# Altium schematic sheet 19 PF0100 PMIC.SchDoc
size 513 x 386 mm
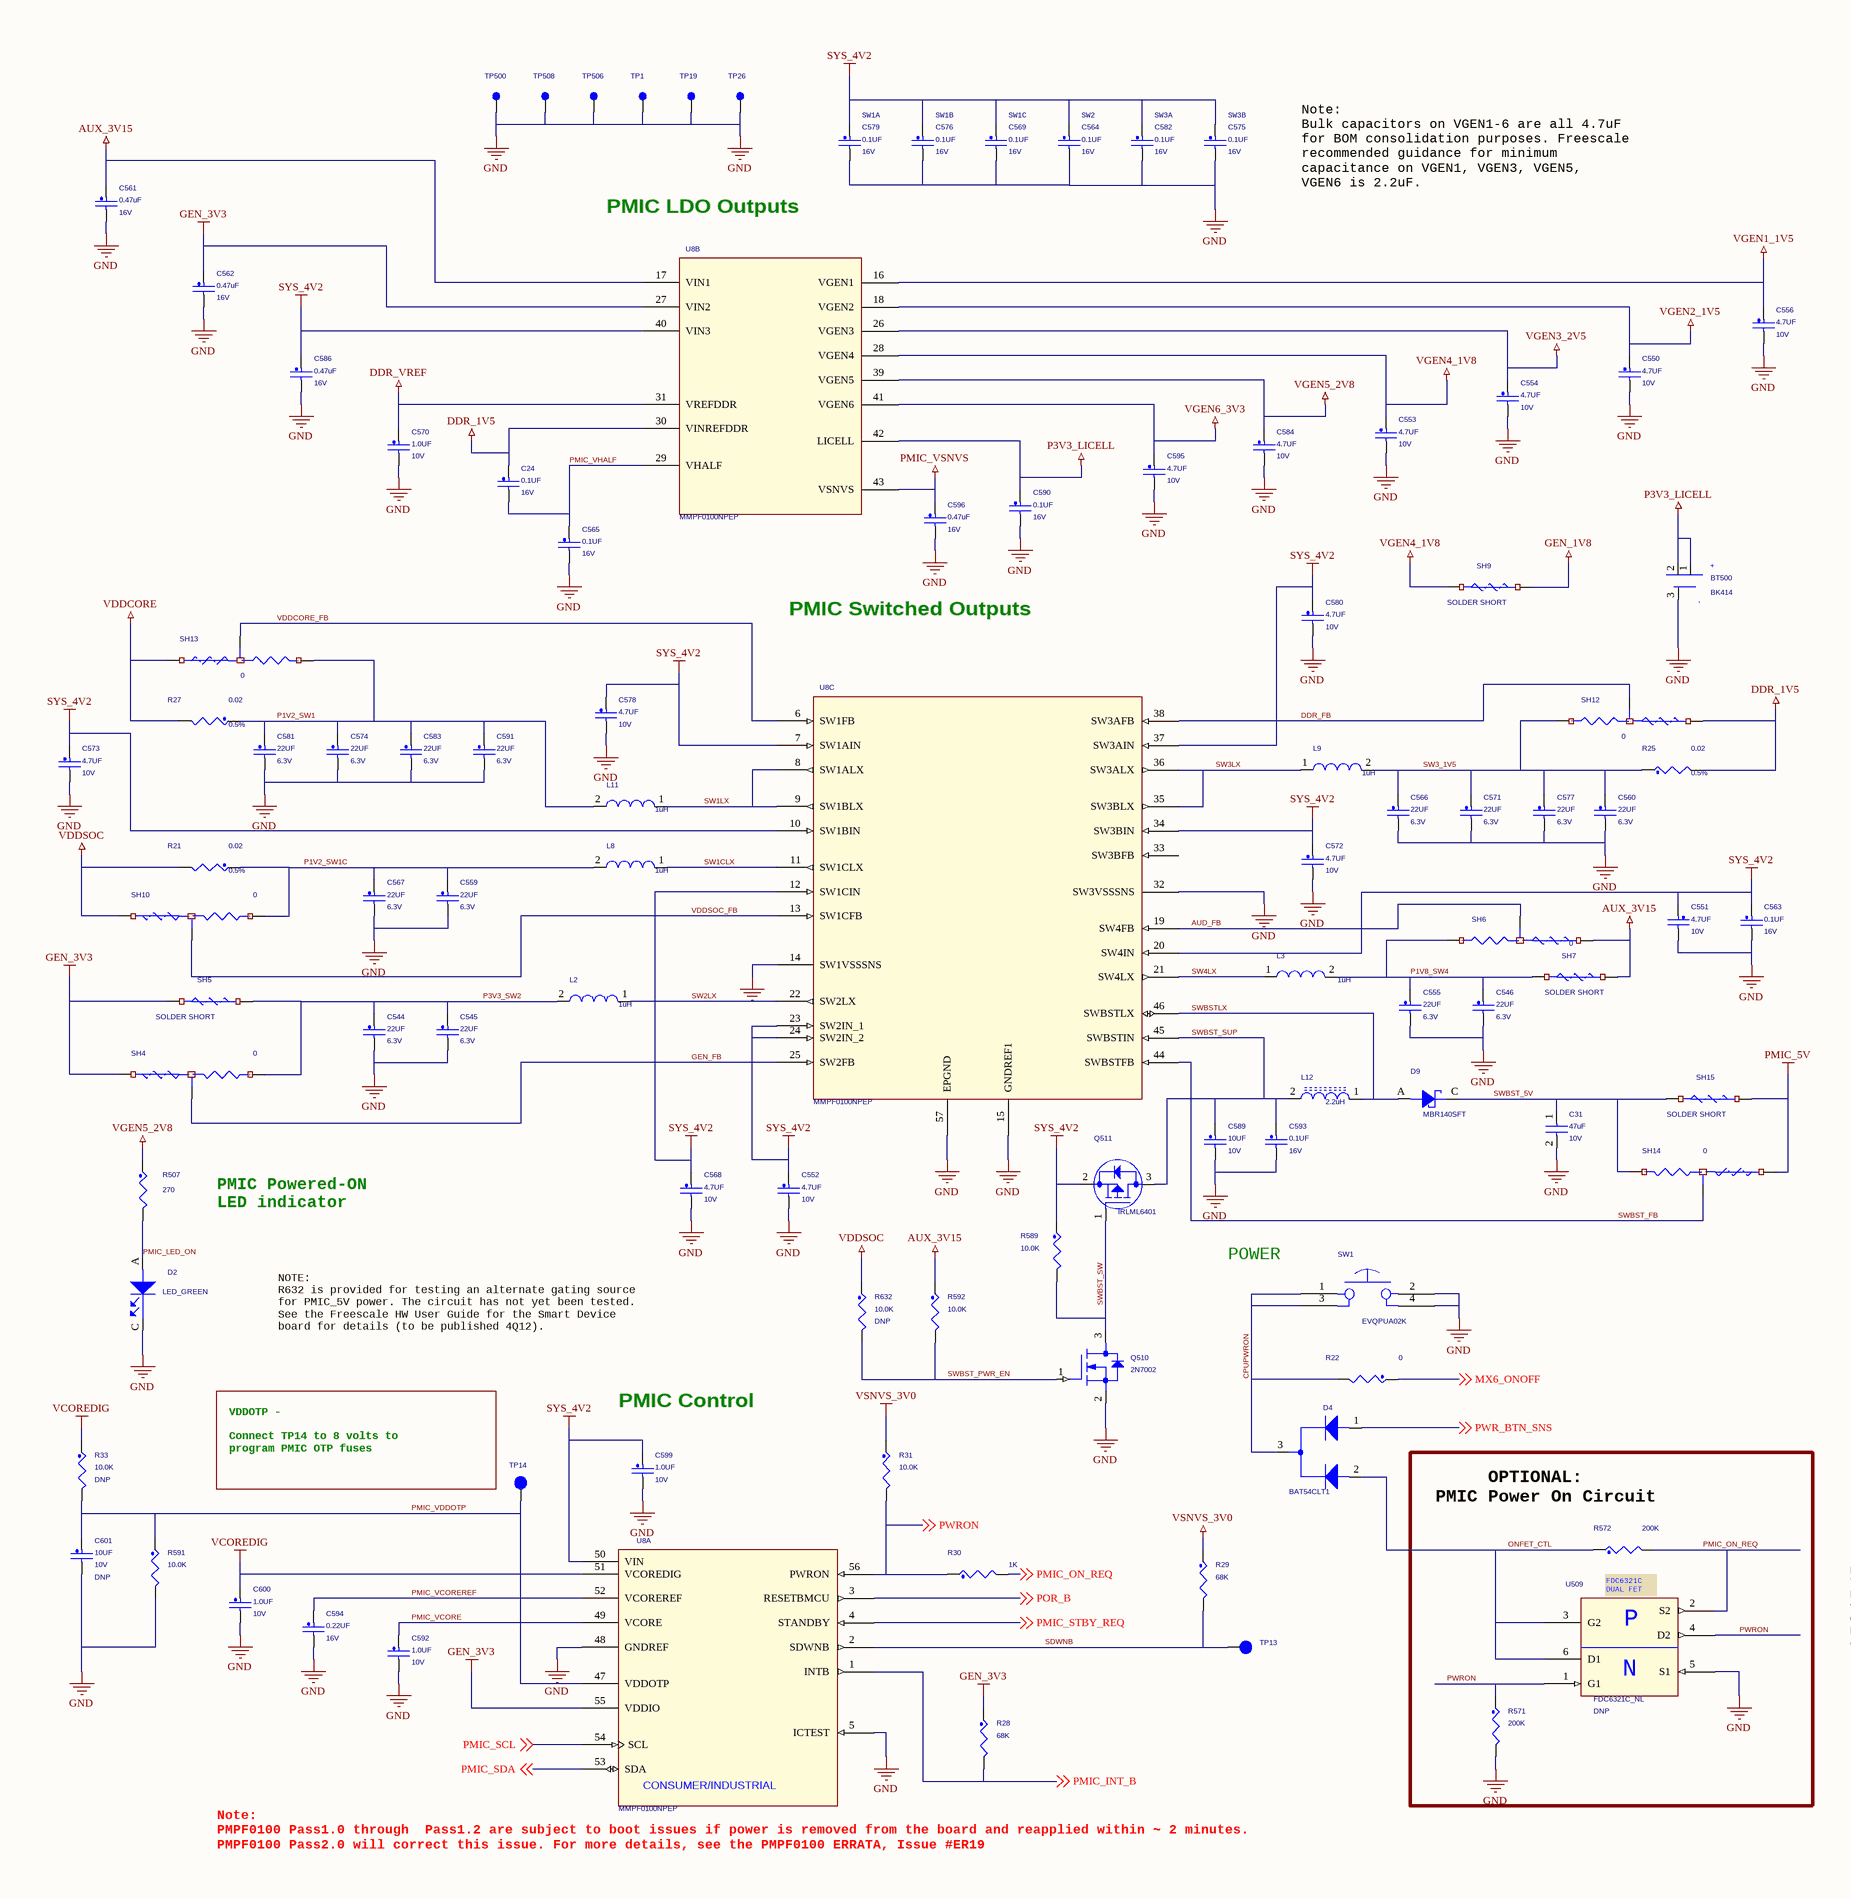
[diagram p0: 19 PF0100 PMIC.SchDoc, left]
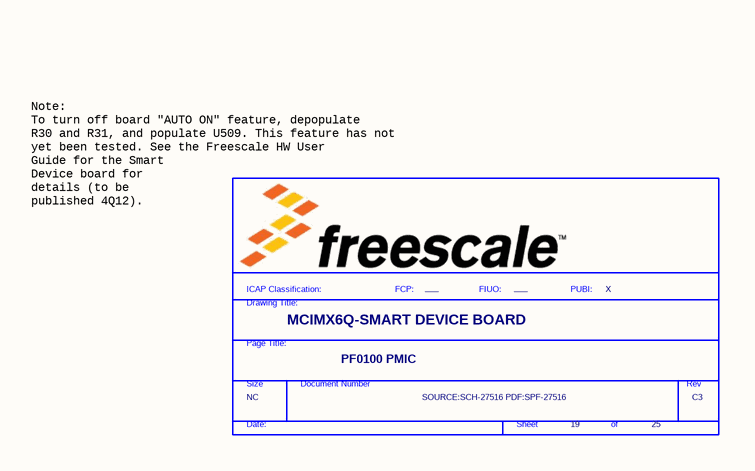
[diagram p1: 19 PF0100 PMIC.SchDoc, right]

## Parts
*  FIUO: ___  PUBI: X  Doc: SOURCE:SCH-27516 PDF:SPF-27516  RevCode: C3  Title: MCIMX6Q-SMART DEVICE BOARD  Page Size: NC  Page Number: 19  Page Count: 25  PageTitle: PF0100 PMIC  (hidden comment: TitleBlock_FS)  (graphical)
BT500  BK414  [batt_retainer_5p08x5p3]
C24  0.1UF  WVDC: 16V  [0402_CC]
C31  47uF  WVDC: 10V  [1206_CC]
C544  22UF  WVDC: 6.3V  [0603_CC]
C545  22UF  WVDC: 6.3V  [0603_CC]
C546  22UF  WVDC: 6.3V  [0603_CC]
C550  4.7UF  WVDC: 10V  [0603_CC]
C551  4.7UF  WVDC: 10V  [0603_CC]
C552  4.7UF  WVDC: 10V  [0603_CC]
C553  4.7UF  WVDC: 10V  [0603_CC]
C554  4.7UF  WVDC: 10V  [0603_CC]
C555  22UF  WVDC: 6.3V  [0603_CC]
C556  4.7UF  WVDC: 10V  [0603_CC]
C559  22UF  WVDC: 6.3V  [0603_CC]
C560  22UF  WVDC: 6.3V  [0603_CC]
C561  0.47uF  WVDC: 16V  [0402_CC]
C562  0.47uF  WVDC: 16V  [0402_CC]
C563  0.1UF  WVDC: 16V  [0402_CC]
C564  0.1UF  WVDC: 16V  [0402_CC]
C565  0.1UF  WVDC: 16V  [0402_CC]
C566  22UF  WVDC: 6.3V  [0603_CC]
C567  22UF  WVDC: 6.3V  [0603_CC]
C568  4.7UF  WVDC: 10V  [0603_CC]
C569  0.1UF  WVDC: 16V  [0402_CC]
C570  1.0UF  WVDC: 10V  [0402_CC]
C571  22UF  WVDC: 6.3V  [0603_CC]
C572  4.7UF  WVDC: 10V  [0603_CC]
C573  4.7UF  WVDC: 10V  [0603_CC]
C574  22UF  WVDC: 6.3V  [0603_CC]
C575  0.1UF  WVDC: 16V  [0402_CC]
C576  0.1UF  WVDC: 16V  [0402_CC]
C577  22UF  WVDC: 6.3V  [0603_CC]
C578  4.7UF  WVDC: 10V  [0603_CC]
C579  0.1UF  WVDC: 16V  [0402_CC]
C580  4.7UF  WVDC: 10V  [0603_CC]
C581  22UF  WVDC: 6.3V  [0603_CC]
C582  0.1UF  WVDC: 16V  [0402_CC]
C583  22UF  WVDC: 6.3V  [0603_CC]
C584  4.7UF  WVDC: 10V  [0603_CC]
C586  0.47uF  WVDC: 16V  [0402_CC]
C589  10UF  WVDC: 10V  [0603_CC]
C590  0.1UF  WVDC: 16V  [0402_CC]
C591  22UF  WVDC: 6.3V  [0603_CC]
C592  1.0UF  WVDC: 10V  [0402_CC]
C593  0.1UF  WVDC: 16V  [0402_CC]
C594  0.22UF  WVDC: 16V  [0402_CC]
C595  4.7UF  WVDC: 10V  [0603_CC]
C596  0.47uF  WVDC: 16V  [0402_CC]
C599  1.0UF  WVDC: 10V  [0402_CC]
C600  1.0UF  WVDC: 10V  [0402_CC]
C601  10UF  WVDC: 10V  ASSY_OPT: DNP  [0603_CC]
D2  LED_GREEN  [LED_0603]
D4  BAT54CLT1  [sot23_a]
D9  MBR140SFT  [sod123lf]
L2  1uH  [ind_vls252010]
L3  1uH  [ind_vls252010]
L8  1uH  [ind_vls252010]
L9  1uH  [ind_5015]
L11  1uH  [ind_5015]
L12  2.2uH  [ind_LPS4018]
Q510  2N7002  [SOT23]
Q511  IRLML6401  [sot-23]
R21  0.02  Tolerance: 0.5%  [0805_CC]
R22  0  [0402_CC]
R25  0.02  Tolerance: 0.5%  [0805_CC]
R27  0.02  Tolerance: 0.5%  [0805_CC]
R28  68K  [0402_CC]
R29  68K  [0402_CC]
R30  1K  [0201_CC]
R31  10.0K  [0402_CC]
R33  10.0K  ASSY_OPT: DNP  [0402_CC]
R507  270  [0402_CC]
R571  200K  [0603_CC]
R572  200K  [0603_CC]
R589  10.0K  [0402_CC]
R591  10.0K  [0402_CC]
R592  10.0K  [0402_CC]
R632  10.0K  ASSY_OPT: DNP  [0402_CC]
SH4  0  [SH0603-X2_PIN1TO2]
SH5  SOLDER SHORT  [SH0805_40]
SH6  0  [SH0603-X2_PIN1TO2]
SH7  SOLDER SHORT  [SH0805_40]
SH9  SOLDER SHORT  [SH0805_40]
SH10  0  [SH0603-X2_PIN1TO2]
SH12  0  [SH0603-X2_PIN1TO2]
SH13  0  [SH0603-X2_PIN1TO2]
SH14  0  [SH0603-X2_PIN1TO2]
SH15  SOLDER SHORT  [SH0805_40]
SW1  EVQPUA02K  [sw_spst_pb_4p8x3p5_sm]
TP1  TEST POINT  [C035S]  (value not drawn)
TP13  tpad_020  [tpad_020]  (value not drawn)
TP14  tpad_020  [tpad_020]  (value not drawn)
TP19  TEST POINT  [C035S]  (value not drawn)
TP26  TEST POINT  [C035S]  (value not drawn)
TP500  TEST POINT  [C035S]  (value not drawn)
TP506  TEST POINT  [C035S]  (value not drawn)
TP508  TEST POINT  [C035S]  (value not drawn)
U8  MMPF0100NPEP  [qfn56ep_0p5_8x8mm]  (parts A,B,C of 3)
U509  FDC6321C_NL  ASSY_OPT: DNP  [SOT23-6]

## Nets
AUX_3V15: C561.1 R592.1 SH6.1 SH7.1 U8.17(VIN1)
DDR_1V5: C24.1 R25.2 SH12.1 U8.30(VINREFDDR)
DDR_VREF: C570.1 U8.31(VREFDDR)
GEN_1V8: SH9.1
GEN_3V3: C562.1 R28.1 SH4.1 SH5.2 U8.27(VIN2) U8.55(VDDIO)
GND: BT500.3(neg) C31.2 C544.2 C545.2 C546.2 C550.2 C551.2 C552.2 C553.2 C554.2 C555.2 C556.2 C559.2 C560.2 C561.2 C562.2 C563.2 C564.2 C565.2 C566.2 C567.2 C568.2 C569.2 C570.2 C571.2 C572.2 C573.2 C574.2 C575.2 C576.2 C577.2 C578.2 C579.2 C580.2 C581.2 C582.2 C583.2 C584.2 C586.2 C589.2 C590.2 C591.2 C592.2 C593.2 C594.2 C595.2 C596.2 C599.2 C600.2 C601.2 D2.C(CATHODE) Q510.2(SOURCE) R571.2 R591.2 SW1.2 SW1.4 TP1.1(Pin1) TP19.1(Pin1) TP26.1(Pin1) TP500.1(Pin1) TP506.1(Pin1) TP508.1(Pin1) U8.5(ICTEST) U8.14(SW1VSSSNS) U8.15(GNDREF1) U8.32(SW3VSSSNS) U8.48(GNDREF) U8.57(EPGND) U509.5(S1)
P3V3_LICELL: BT500.1(pos1) BT500.2(pos2) C590.1 U8.42(LICELL)
PMIC_5V: SH14.1 SH15.1
PMIC_VSNVS: C596.1 U8.43(VSNVS)
SYS_4V2: C551.1 C552.1 C563.1 C564.1 C568.1 C569.1 C572.1 C573.1 C575.1 C576.1 C578.1 C579.1 C580.1 C582.1 C586.1 C599.1 Q511.2(SOURCE) R589.1 U8.7(SW1AIN) U8.10(SW1BIN) U8.12(SW1CIN) U8.20(SW4IN) U8.23(SW2IN_1) U8.24(SW2IN_2) U8.34(SW3BIN) U8.37(SW3AIN) U8.40(VIN3) U8.50(VIN)
VCOREDIG: C600.1 R33.1 U8.51(VCOREDIG)
VDDCORE: R27.2 SH13.1
VDDSOC: R21.2 R632.1 SH10.1
VGEN1_1V5: C556.1 U8.16(VGEN1)
VGEN2_1V5: C550.1 U8.18(VGEN2)
VGEN3_2V5: C554.1 U8.26(VGEN3)
VGEN4_1V8: C553.1 SH9.2 U8.28(VGEN4)
VGEN5_2V8: C584.1 R507.1 U8.39(VGEN5)
VGEN6_3V3: C595.1 U8.41(VGEN6)
VSNVS_3V0: R29.1 R31.1
AUD_FB: SH6.2 U8.19(SW4FB)
CPUPWRON: D4.3(C) R22.2 SW1.1 SW1.3
DDR_FB: SH12.2 U8.38(SW3AFB)
GEN_FB: SH4.2 U8.25(SW2FB)
MX6_ONOFF: R22.1 ; off-sheet MX6_ONOFF
ONFET_CTL: D4.2(A2) R572.1 U509.3(G2) U509.6(D1)
P1V2_SW1: C574.1 C581.1 C583.1 C591.1 L11.2 R27.1 SH13.3
P1V2_SW1C: C559.1 C567.1 L8.2 R21.1 SH10.3
P1V8_SW4: C546.1 C555.1 L3.2 SH6.3 SH7.2
P3V3_SW2: C544.1 C545.1 L2.2 SH4.3 SH5.1
PMIC_INT_B: R28.2 U8.1(INTB) ; off-sheet PMIC_INT_B
PMIC_LED_ON: D2.A(ANODE) R507.2
PMIC_ON_REQ: R30.2 R572.2 U509.2(S2) ; off-sheet PMIC_ON_REQ
PMIC_SCL: U8.54(SCL) ; off-sheet PMIC_SCL
PMIC_SDA: U8.53(SDA) ; off-sheet PMIC_SDA
PMIC_STBY_REQ: U8.4(STANDBY) ; off-sheet PMIC_STBY_REQ
PMIC_VCORE: C592.1 U8.49(VCORE)
PMIC_VCOREREF: C594.1 U8.52(VCOREREF)
PMIC_VDDOTP: C601.1 R33.2 R591.1 TP14.1(Pin1) U8.47(VDDOTP)
PMIC_VHALF: C24.2 C565.1 U8.29(VHALF)
POR_B: U8.3(RESETBMCU) ; off-sheet POR_B
PWR_BTN_SNS: D4.1(A1) ; off-sheet PWR_BTN_SNS
PWRON: R30.1 R31.2 R571.1 U8.56(PWRON) U509.1(G1) U509.4(D2) ; off-sheet PWRON
SDWNB: R29.2 TP13.1(Pin1) U8.2(SDWNB)
SW1CLX: L8.1 U8.11(SW1CLX)
SW1LX: L11.1 U8.8(SW1ALX) U8.9(SW1BLX)
SW2LX: L2.1 U8.22(SW2LX)
SW3_1V5: C560.1 C566.1 C571.1 C577.1 L9.2 R25.1 SH12.3
SW3LX: L9.1 U8.35(SW3BLX) U8.36(SW3ALX)
SW4LX: L3.1 U8.21(SW4LX)
SWBST_5V: C31.1 D9.C SH14.3 SH15.2
SWBST_FB: SH14.2 U8.44(SWBSTFB)
SWBST_PWR_EN: Q510.1(GATE) R592.2 R632.2
SWBST_SUP: C589.1 C593.1 L12.2 Q511.3(DRAIN) U8.45(SWBSTIN)
SWBST_SW: Q510.3(DRAIN) Q511.1(GATE) R589.2
SWBSTLX: D9.A L12.1 U8.46(SWBSTLX)
VDDCORE_FB: SH13.2 U8.6(SW1FB)
VDDSOC_FB: SH10.2 U8.13(SW1CFB)

Not connected (* = marked no-connect by the designer): U8 33(SW3BFB)

## Notes on the sheet
- (near C579) SW1A
- (near C576) SW1B
- (near C569) SW1C
- (near C564) SW2
- (near C582) SW3A
- (near C575) SW3B
- Note:
  Bulk capacitors on VGEN1-6 are all 4.7uF
  for BOM consolidation purposes. Freescale
  recommended guidance for minimum
  capacitance on VGEN1, VGEN3, VGEN5,
  VGEN6 is 2.2uF.
- PMIC LDO Outputs
- PMIC Switched Outputs
- PMIC Powered-ON
  LED indicator
- (near R632) NOTE:
  R632 is provided for testing an alternate gating source
  for PMIC_5V power. The circuit has not yet been tested.
  See the Freescale HW User Guide for the Smart Device
  board for details (to be published 4Q12).
- POWER
- (near TP14) VDDOTP -
  Connect TP14 to 8 volts to
  program PMIC OTP fuses
- PMIC Control
- (near R572) OPTIONAL:
  PMIC Power On Circuit
- (near *) Note:
  To turn off board "AUTO ON" feature, depopulate
  R30 and R31, and populate U509. This feature has not
  yet been tested. See the Freescale HW User
  Guide for the Smart
  Device board for
  details (to be
  published 4Q12).
- Note:
  PMPF0100 Pass1.0 through  Pass1.2 are subject to boot issues if power is removed from the board and reapplied within ~ 2 minutes.
  PMPF0100 Pass2.0 will correct this issue. For more details, see the PMPF0100 ERRATA, Issue #ER19
- (in symbol BATTERY_SKT_3V) +; -
- (in symbol FDC6321C) FDC6321C / DUAL FET; P; N
- (in symbol MMPF0100NPEP_56P, part A) CONSUMER/INDUSTRIAL
- (in symbol TitleBlock_FS) ICAP Classification:; FCP:; FIUO:; PUBI:; Drawing Title:; Page Title:; Size; Document Number; Rev; Date:; Sheet; of

## Library data of the parts
* = TitleBlock_FS: OrgAddr2: Austin, TX 78735-8598; OrgAddr1: 6501 William Cannon Drive West; OrgName: Freescale Semiconductor; FCP: ___; Page Create Date: March  8, 1995
BT500 = BATTERY_SKT_3V: BATTERY HOLDER COIN CELL 414 SMT; CLASS: IC; CAD_APPROVED: Yes; MFG_PN01: BK-414-TR; MFG_NAME01: MEMORY PROTECTION DEVICES INC; AGILE_PN: 801-76168; HEIGHT: 2.66MM; ROHS: Yes
C24 C565 C569 C579 C582 = CAP_NP: CAP CER 0.1UF 16V 10% X7R 0402; CLASS: DISCRETE; SIGNAL_MODEL: DEFAULT_CAPACITOR_100000pF_2_1; AGILE_PN: 150-75182; MFG_NAME01: KEMET; MFG_PN01: C0402C104K4RAC; CAD_APPROVED: Yes; FPLIST: CC0402_25,CC0402_HD,0402_CC; Tolerance: 10%; ROHS: Yes; HEIGHT: 0.635MM; TOL: 10%; VOLTAGE: 16V
C31 = MOT_CAP: CAP CER 47uF 10V 20% X5R 1206; CLASS: DISCRETE; SIGNAL_MODEL: DEFAULT_CAPACITOR_4.7e+07pF_2_1; AGILE_PN: 150-78578; MFG_NAME01: TAIYO YUDEN; MFG_PN01: LMK316BJ476ML-T; CAD_APPROVED: Yes; FPLIST: CC1206_OV,CC1206,1206_CC; VOLTAGE: 10V; Tolerance: 20%; ROHS: Yes; HEIGHT: 1.80MM
C544-C546 = CAP_NP: CAP CER 22UF 6.3V 20% X5R 0603; CLASS: DISCRETE; SIGNAL_MODEL: DEFAULT_CAPACITOR_2.2e+07pF_2_1; AGILE_PN: 150-78467; MFG_NAME01: Samsung; MFG_PN01: CL10A226MQ8NRNE; CAD_APPROVED: Yes; FPLIST: CC0603_OV,CC0603,0603_CC; Tolerance: 20%; ROHS: Yes; HEIGHT: 1MM; VOLTAGE: 6.3V
C550 C573 C578 C584 = CAP_NP: CAP CER 4.7UF 10V 10% X5R 0603; CLASS: DISCRETE; SIGNAL_MODEL: DEFAULT_CAPACITOR_4.7e+06pF_2_1; FPLIST: CC0603_OV,CC0603,0603_CC; CAD_APPROVED: Yes; MFG_PN01: LMK107BJ475KA-T; MFG_NAME01: TAIYO YUDEN; AGILE_PN: 150-77975; HEIGHT: 0.9MM; ROHS: Yes; Tolerance: 10%; VOLTAGE: 10V
  C550 C584: TOL: 10%
C551-C554 C556 C568 C572 C580 C595 = CAP_NP: CAP CER 4.7UF 10V 10% X5R 0603; CLASS: DISCRETE; SIGNAL_MODEL: DEFAULT_CAPACITOR_4.7e+06pF_2_1; AGILE_PN: 150-77975; MFG_NAME01: TAIYO YUDEN; MFG_PN01: LMK107BJ475KA-T; CAD_APPROVED: Yes; FPLIST: CC0603_OV,CC0603,0603_CC; Tolerance: 10%; ROHS: Yes; HEIGHT: 0.9MM; VOLTAGE: 10V
  C553 C554 C556 C595: TOL: 10%
C555 = CAP_NP: CAP CER 22UF 6.3V 20% X5R 0603; CLASS: DISCRETE; FPLIST: CC0603_OV,CC0603,0603_CC; CAD_APPROVED: Yes; MFG_PN01: CL10A226MQ8NRNE; MFG_NAME01: Samsung; AGILE_PN: 150-78467; SIGNAL_MODEL: DEFAULT_CAPACITOR_2.2e+07pF_2_1; HEIGHT: 1MM; ROHS: Yes; Tolerance: 20%; VOLTAGE: 6.3V
C559 C571 C581 C583 = CAP_NP: CAP CER 22UF 4V 20% X5R 0603; CLASS: DISCRETE; SIGNAL_MODEL: DEFAULT_CAPACITOR_2.2e+07pF_2_1; FPLIST: CC0603_OV,CC0603,0603_CC; CAD_APPROVED: Yes; MFG_PN01: AMK107BJ226MA-T; MFG_NAME01: TAIYO YUDEN; AGILE_PN: 150-77974; VOLTAGE: 4.0V; HEIGHT: 0.9MM; ROHS: Yes; Tolerance: 20%
C560 C566 C567 C574 C577 C591 = CAP_NP: CAP CER 22UF 4V 20% X5R 0603; CLASS: DISCRETE; SIGNAL_MODEL: DEFAULT_CAPACITOR_2.2e+07pF_2_1; AGILE_PN: 150-77974; MFG_NAME01: TAIYO YUDEN; MFG_PN01: AMK107BJ226MA-T; CAD_APPROVED: Yes; FPLIST: CC0603_OV,CC0603,0603_CC; VOLTAGE: 4.0V; Tolerance: 20%; ROHS: Yes; HEIGHT: 0.9MM
C561 C562 C586 = CAP_NP: CAP CER 0.47uF 16V 10% X5R 0402; CLASS: DISCRETE; FPLIST: CC0402_25,CC0402_HD,0402_CC; CAD_APPROVED: Yes; MFG_PN01: C1005X5R1C474K; MFG_NAME01: TDK; AGILE_PN: 150-78972; SIGNAL_MODEL: DEFAULT_CAPACITOR_100000pF_2_1; VOLTAGE: 16V; TOL: 10%; HEIGHT: 0.55 MM; ROHS: Yes; Tolerance: 10%
C563 C564 C575 C576 C590 = CAP_NP: CAP CER 0.1UF 16V 10% X7R 0402; CLASS: DISCRETE; SIGNAL_MODEL: DEFAULT_CAPACITOR_100000pF_2_1; FPLIST: CC0402_25,CC0402_HD,0402_CC; CAD_APPROVED: Yes; MFG_PN01: C0402C104K4RAC; MFG_NAME01: KEMET; AGILE_PN: 150-75182; TOL: 10%; HEIGHT: 0.635MM; ROHS: Yes; Tolerance: 10%; VOLTAGE: 16V
C570 C592 = CAP_NP: CAP CER 1.0UF 10V 10% X5R 0402; CLASS: DISCRETE; SIGNAL_MODEL: DEFAULT_CAPACITOR_1e+06pF_2_1; AGILE_PN: 150-75772; MFG_NAME01: YAGEO AMERICA; MFG_PN01: CC0402KRX5R6BB105; CAD_APPROVED: Yes; FPLIST: CC0402_25,CC0402_HD,0402_CC; ROHS: Yes; HEIGHT: 0.6MM; TOL: 10%
C589 = CAP_NP: CAP CER 10UF 10V 20% X5R 0603; CLASS: DISCRETE; AGILE_PN: 150-78609; MFG_NAME01: TAIYO YUDEN; MFG_PN01: LMK107BJ106MALTD; CAD_APPROVED: Yes; FPLIST: CC0603_OV,CC0603,0603_CC; SIGNAL_MODEL: DEFAULT_CAPACITOR_1e+07pF_2_1; ROHS: Yes; HEIGHT: 1.016MM
C593 = CAP_NP: CAP CER 0.1UF 16V 10% X7R 0402; CLASS: DISCRETE; AGILE_PN: 150-75182; MFG_NAME01: KEMET; MFG_PN01: C0402C104K4RAC; CAD_APPROVED: Yes; FPLIST: CC0402_25,CC0402_HD,0402_CC; SIGNAL_MODEL: DEFAULT_CAPACITOR_100000pF_2_1; VOLTAGE: 16V; Tolerance: 10%; ROHS: Yes; HEIGHT: 0.635MM; TOL: 10%
C594 = CAP_NP: CAP CER 0.22UF 16V 10% X5R 0402; CLASS: DISCRETE; FPLIST: CC0402_25,CC0402_HD,0402_CC; CAD_APPROVED: Yes; MFG_PN01: EMK105BJ224KV-F; MFG_NAME01: TAIYO YUDEN; AGILE_PN: 150-77913; SIGNAL_MODEL: DEFAULT_CAPACITOR_100000pF_2_1; VOLTAGE: 16V; TOL: 10%; HEIGHT: 0.55MM; ROHS: Yes; Tolerance: 10%
C596 = CAP_NP: CAP CER 0.47uF 16V 10% X5R 0402; CLASS: DISCRETE; AGILE_PN: 150-78972; MFG_NAME01: TDK; MFG_PN01: C1005X5R1C474K; CAD_APPROVED: Yes; FPLIST: CC0402_25,CC0402_HD,0402_CC; SIGNAL_MODEL: DEFAULT_CAPACITOR_100000pF_2_1; VOLTAGE: 16V; Tolerance: 10%; ROHS: Yes; HEIGHT: 0.55 MM; TOL: 10%
C599 = CAP_NP: CAP CER 1.0UF 10V 10% X5R 0402; CLASS: DISCRETE; FPLIST: CC0402_25,CC0402_HD,0402_CC; CAD_APPROVED: Yes; MFG_PN01: CC0402KRX5R6BB105; MFG_NAME01: YAGEO AMERICA; AGILE_PN: 150-75772; SIGNAL_MODEL: DEFAULT_CAPACITOR_1e+06pF_2_1; TOL: 10%; HEIGHT: 0.6MM; ROHS: Yes
C600 = CAP_NP: CAP CER 1.0UF 10V 10% X5R 0402; CLASS: DISCRETE; SIGNAL_MODEL: DEFAULT_CAPACITOR_1e+06pF_2_1; FPLIST: CC0402_25,CC0402_HD,0402_CC; CAD_APPROVED: Yes; MFG_PN01: CC0402KRX5R6BB105; MFG_NAME01: YAGEO AMERICA; AGILE_PN: 150-75772; HEIGHT: 0.6MM; ROHS: Yes
C601 = CAP_NP: CAP CER 10UF 10V 20% X5R 0603; CLASS: DISCRETE; SIGNAL_MODEL: DEFAULT_CAPACITOR_1e+07pF_2_1; AGILE_PN: 150-78609; MFG_NAME01: TAIYO YUDEN; MFG_PN01: LMK107BJ106MALTD; CAD_APPROVED: Yes; FPLIST: CC0603_OV,CC0603,0603_CC; PRIORITY_PN: 021-00276; ROHS: Yes; HEIGHT: 1.016MM
D2 = LED: LED ULTRA-BRIGHT GREEN SMT 0603; CLASS: IC; AGILE_PN: 370-75077; MFG_NAME01: LITE ON; MFG_PN01: LTST-C190KGKT; CAD_APPROVED: YES; ROHS: Yes; HEIGHT: 0.8MM
D4 = DUALDIODE_CC_SOT23: DIODE SCH DUAL CC 200MA 30V SOT23; CLASS: IC; CAD_APPROVED: Yes; MFG_PN01: BAT54CLT1G; MFG_NAME01: ON SEMICONDUCTOR; AGILE_PN: 480-77657; HEIGHT: 1.11MM; ROHS: Yes
D9 = DIODE_SCHTKY: DIODE SCH PWR RECT 1A 40V SOD123; CLASS: IC; FPLIST: sod123lf,SOD123; CAD_APPROVED: Yes; MFG_PN01: MBR140SFT1G; MFG_NAME01: ON SEMICONDUCTOR; AGILE_PN: 480-30006; HEIGHT: 1.0 MM; ROHS: Yes
L2 = INDUCTOR: IND PWR 1UH@1MHZ 2A 30% SMT; PART_TYPE: INDUCTOR\POWER; CLASS: DISCRETE; SIGNAL_MODEL: DEFAULT_INDUCTOR_1000nH_2_1; AGILE_PN: 180-77708; MFG_NAME01: TDK; MFG_PN01: VLS252010T-1R0N; CAD_APPROVED: Yes; Tolerance: 30%; ROHS: Yes; HEIGHT: 1.0 MM
L3 L8 = INDUCTOR: IND PWR 1UH@1MHZ 2A 30% SMT; PART_TYPE: INDUCTOR\POWER; CLASS: DISCRETE; SIGNAL_MODEL: DEFAULT_INDUCTOR_1000nH_2_1; CAD_APPROVED: Yes; MFG_PN01: VLS252010T-1R0N; MFG_NAME01: TDK; AGILE_PN: 180-77708; HEIGHT: 1.0 MM; ROHS: Yes; Tolerance: 30%
L9 L11 = INDUCTOR: IND PWR 1UH@100KHZ 2.65A 20% SMT; CLASS: DISCRETE; SIGNAL_MODEL: DEFAULT_INDUCTOR_1000nH_2_1; AGILE_PN: 180-77883; MFG_NAME01: Coilcraft; MFG_PN01: LPS5015-102MLC; CAD_APPROVED: Yes; Tolerance: 20%; ROHS: Yes; HEIGHT: 1.5MM; PART_TYPE: INDUCTOR
L12 = INDUCTOR_FERRITE_A: IND PWR 2.2uH@100KHz 2.7A 20% SMT; PART_TYPE: POWER; CLASS: DISCRETE; AGILE_PN: 180-77745; MFG_NAME01: COILCRAFT; MFG_PN01: LPS4018-222MLC; CAD_APPROVED: Yes; SIGNAL_MODEL: DEFAULT_INDUCTOR_2200nH_2_1; Tolerance: 20%; ROHS: Yes; HEIGHT: 1.8MM
Q510 = 2N7002: TRAN NMOS 60V 115MA SOT23; CLASS: IC; CAD_APPROVED: Yes; MFG_PN01: 2N7002LT1G; MFG_NAME01: ON SEMICONDUCTOR; AGILE_PN: 480-75159; HEIGHT: 1.3MM; ROHS: Yes
Q511 = MOSFET_P: TRAN PMOS PWR 12V 4.3A SOT23; CLASS: IC; AGILE_PN: 480-77718; MFG_NAME01: INTERNATIONAL RECTIFIER; MFG_PN01: IRLML6401TRPBF; CAD_APPROVED: Yes; ROHS: Yes; HEIGHT: 1.12MM
R21 R25 = RES: RES MF 0.02OHM 1/4W 0.5% 0805; CLASS: DISCRETE; SIGNAL_MODEL: DEFAULT_RESISTOR_0.02OHM_2_1; FPLIST: RC0805_OV,RC0805,0805_CC; CAD_APPROVED: Yes; MFG_PN01: WSL0805R0200DEA18; MFG_NAME01: VISHAY INTERTECHNOLOGY; AGILE_PN: 470-79241; ROHS: Yes
R22 = RES: RES MF ZERO OHM 1/10W -- 0402; CLASS: DISCRETE; AGILE_PN: 470-79965; MFG_NAME01: Panasonic; MFG_PN01: ERJ-2GE0R00X; CAD_APPROVED: Yes; FPLIST: RC0402_25,RC0402_HD,RC0402_X2,0402_CC; ROHS: Yes
R27 = RES: RES MF 0.02OHM 1/4W 0.5% 0805; CLASS: DISCRETE; FPLIST: RC0805_OV,RC0805,0805_CC; CAD_APPROVED: Yes; MFG_PN01: WSL0805R0200DEA18; MFG_NAME01: VISHAY INTERTECHNOLOGY; AGILE_PN: 470-79241; SIGNAL_MODEL: DEFAULT_RESISTOR_0.02OHM_2_1; ROHS: Yes
R28 = RES: RES MF 68K  1/16W 1% 0402; CLASS: DISCRETE; SIGNAL_MODEL: DEFAULT_RESISTOR_68000OHM_2_1; AGILE_PN: 470-31042; MFG_NAME01: KOA SPEER; MFG_PN01: RK73H1ETTP6802F; CAD_APPROVED: Yes; FPLIST: RC0402_25,RC0402_HD,0402_CC; PRIORITY_PN: 006-00730; ROOM: JTAG; Tolerance: 1%; ROHS: Yes
R29 = RES: RES MF 68K  1/16W 1% 0402; CLASS: DISCRETE; SIGNAL_MODEL: DEFAULT_RESISTOR_68000OHM_2_1; ROOM: JTAG; PRIORITY_PN: 006-00730; FPLIST: RC0402_25,RC0402_HD,0402_CC; CAD_APPROVED: Yes; MFG_PN01: RK73H1ETTP6802F; MFG_NAME01: KOA SPEER; AGILE_PN: 470-31042; ROHS: Yes; Tolerance: 1%
R30 = RES: RES MF 1.0K 1/20W 5% 0201; CLASS: DISCRETE; SIGNAL_MODEL: DEFAULT_RESISTOR_1000OHM_2_1; FPLIST: RC0201,0201_CC; CAD_APPROVED: Yes; MFG_PN01: RK73B1HTTC102J; MFG_NAME01: KOA SPEER; AGILE_PN: 470-79245; ROHS: Yes; Tolerance: 5%
R31 = RES: RES MF 10.0K 1/16W 1% 0402; CLASS: DISCRETE; SIGNAL_MODEL: DEFAULT_RESISTOR_10000OHM_2_1; AGILE_PN: 470-75416; MFG_NAME01: VISHAY INTERTECHNOLOGY; MFG_PN01: CRCW040210K0FKED; CAD_APPROVED: Yes; FPLIST: RC0402_25,RC0402_HD,0402_CC; PRIORITY_PN: 006-00771; Tolerance: 1%; ROHS: Yes
R33 R589 = RES: RES MF 10.0K 1/16W 1% 0402; CLASS: DISCRETE; SIGNAL_MODEL: DEFAULT_RESISTOR_10000OHM_2_1; FPLIST: RC0402_25,RC0402_HD,0402_CC; CAD_APPROVED: Yes; MFG_PN01: CRCW040210K0FKED; MFG_NAME01: VISHAY INTERTECHNOLOGY; AGILE_PN: 470-75416; ROHS: Yes; Tolerance: 1%
R507 = RES: RES MF 270 OHM 1/16W 5% 0402; CLASS: DISCRETE; SIGNAL_MODEL: DEFAULT_RESISTOR_270OHM_2_1; AGILE_PN: 470-30332; MFG_NAME01: VISHAY INTERTECHNOLOGY; MFG_PN01: CRCW0402270RJNED; CAD_APPROVED: Yes; FPLIST: RC0402_25,RC0402_HD,0402_CC; PRIORITY_PN: 006-00626; Tolerance: 5%; ROHS: Yes
R571 = RES: RES MF 200K 1/10W 1% 0603; CLASS: DISCRETE; AGILE_PN: 470-76381; MFG_NAME01: KOA SPEER; MFG_PN01: RK73H1JTTD2003F; CAD_APPROVED: Yes; FPLIST: RC0603_OV,RC0603,0603_CC; SIGNAL_MODEL: DEFAULT_RESISTOR_200000OHM_2_1; Tolerance: 1%; ROHS: Yes
R572 = RES: RES MF 200K 1/10W 1% 0603; CLASS: DISCRETE; FPLIST: RC0603_OV,RC0603,0603_CC; CAD_APPROVED: Yes; MFG_PN01: RK73H1JTTD2003F; MFG_NAME01: KOA SPEER; AGILE_PN: 470-76381; SIGNAL_MODEL: DEFAULT_RESISTOR_200000OHM_2_1; ROHS: Yes; Tolerance: 1%
R591 = RES: RES MF 10.0K 1/16W 1% 0402; CLASS: DISCRETE; AGILE_PN: 470-75416; MFG_NAME01: VISHAY INTERTECHNOLOGY; MFG_PN01: CRCW040210K0FKED; CAD_APPROVED: Yes; FPLIST: RC0402_25,RC0402_HD,0402_CC; Tolerance: 1%; ROHS: Yes
R592 R632 = RES: RES MF 10.0K 1/16W 1% 0402; CLASS: DISCRETE; FPLIST: RC0402_25,RC0402_HD,0402_CC; CAD_APPROVED: Yes; MFG_PN01: CRCW040210K0FKED; MFG_NAME01: VISHAY INTERTECHNOLOGY; AGILE_PN: 470-75416; SIGNAL_MODEL: DEFAULT_RESISTOR_10000OHM_2_1; ROHS: Yes; Tolerance: 1%
SH4 SH10 SH13 = RES_SHORT-3_1TO2: ZERO OHM CUT TRACE 0603 PADS; NO PART TO ORDER; CLASS: DISCRETE; AGILE_PN: 470-80018; MFG_NAME01: LAYOUT ELEMENT ONLY; ASSY_OPT: DNP; CAD_APPROVED: Yes; FPLIST: SH0603,SH0603_CC,SH0603-X2_PIN1TO2,SH0603-X2_PIN2TO3; MFG_PN01: LAYOUT ELEMENT ONLY; ROHS: Yes
SH5 SH9 SH15 = RES_SHORT-2: SOLDER SHORT 0805  SMT NO PART TO ORDER; CLASS: DISCRETE; FPLIST: SH0805,SH0805CUST,SH0805_40; CAD_APPROVED: Yes; ASSY_OPT: DNP; MFG_PN01: SOLDER_SHORT_0805; MFG_NAME01: NOTACOMPONENT; AGILE_PN: 470-80202; ROHS: Yes
SH6 SH12 SH14 = RES_SHORT-3_1TO2: ZERO OHM CUT TRACE 0603 PADS; NO PART TO ORDER; CLASS: DISCRETE; FPLIST: SH0603,SH0603_CC,SH0603-X2_PIN1TO2,SH0603-X2_PIN2TO3; CAD_APPROVED: Yes; ASSY_OPT: DNP; MFG_PN01: LAYOUT ELEMENT ONLY; AGILE_PN: 470-80018; ROHS: Yes; MFG_NAME01: LAYOUT ELEMENT ONLY
SH7 = RES_SHORT-2: SOLDER SHORT 0805  SMT NO PART TO ORDER; CLASS: DISCRETE; AGILE_PN: 470-80202; MFG_NAME01: NOTACOMPONENT; MFG_PN01: SOLDER_SHORT_0805; ASSY_OPT: DNP; CAD_APPROVED: Yes; FPLIST: SH0805,SH0805CUST,SH0805_40; ROHS: Yes
SW1 = EDGE_MOUNT_PB_SW_2: SW SPST NO PB 2.2N SIDE 12V 50MA SMT; CLASS: IC; CAD_APPROVED: Yes; MFG_NAME01: PANASONIC; AGILE_PN: 510-76838; HEIGHT: 1.95MM; ROHS: Yes; MFG_PN01: EVQPUA02K
TP1 TP19 TP26 TP500 TP506 = Test pad: TEST POINT PAD 35 MIL SMT, NO PART TO ORDER; CLASS: IC; CAD_APPROVED: Yes; ASSY_OPT: DNP; MFG_PN01: NA; AGILE_PN: 280-75148; HEIGHT: 0.1 MM; ROHS: Yes; MFG_NAME01: NA
TP13 TP14 = TESTLOOP: TEST POINT PAD 0.5MM DIA SMT, NO PART TO ORDER; CLASS: IO; CAD_APPROVED: Yes; ASSY_OPT: DNP; AGILE_PN: 211-77484; HEIGHT: 0.1MM; ROHS: Yes
TP508 = Test pad: TEST POINT PAD 35 MIL SMT, NO PART TO ORDER; CLASS: IC; AGILE_PN: 280-75148; MFG_NAME01: NA; ASSY_OPT: DNP; CAD_APPROVED: Yes; MFG_PN01: NA; ROHS: Yes; HEIGHT: 0.1 MM
U8 = MMPF0100NPEP_56P: IC POWER MANAGEMENT CONSUMER/INDUSTRIAL QFN56; SWAP_INFO: (S1+S2+S3); SPLIT_INST: TRUE; CAD_APPROVED: Yes; MFG_NAME01: FREESCALE SEMICONDUCTOR; AGILE_PN: 315-79407; CLASS: IC; HEIGHT: 0.9MM; ROHS: Yes; MFG_PN01: MMPF0100NPEP
U509 = FDC6321C: MOSFET,DUAL N & P CHANNEL, SOT6 ROHS; CLASS: IC; CAD_APPROVED: YES; MFG_NAME01: FAIRCHILD; AGILE_PN: 480-75232; HEIGHT: 1.22 MM; ROHS: Yes; MFG_PN01: FDC6321C_NL